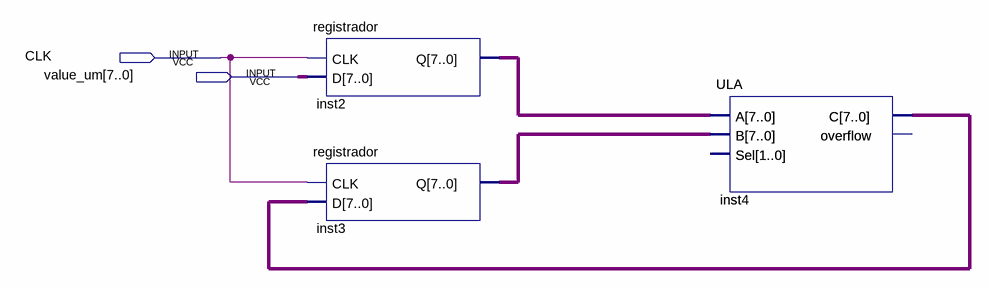
[diagram p0: schematic sheet]
// Quartus schematic circuito_ula_e_regs.bdf as structural Verilog: 4 symbols, 2 pins
module circuito_ula_e_regs (
  input  CLK,
  input  [7:0] value_um
);

  wire inst_overflow;
  wire [1:0] undriven;
  wire [7:0] inst2_q, inst3_q, inst_c;

  registrador inst2 (.CLK(CLK), .D(value_um), .Q(inst2_q));
  registrador inst3 (.CLK(CLK), .D(inst_c), .Q(inst3_q));
  ULA inst (.A(inst2_q), .B(inst3_q), .Sel(undriven), .C(inst_c), .overflow(inst_overflow));
  ULA inst4 (.A(inst2_q), .B(inst3_q), .Sel(undriven), .C(inst_c), .overflow(inst_overflow));
endmodule
